# Altium schematic sheet A3000_16MB_M4.SchDoc: ARM2 to ARM3 Adapter
size A3; DocumentNumber: 1; SheetNumber: 5; SheetTotal: 5
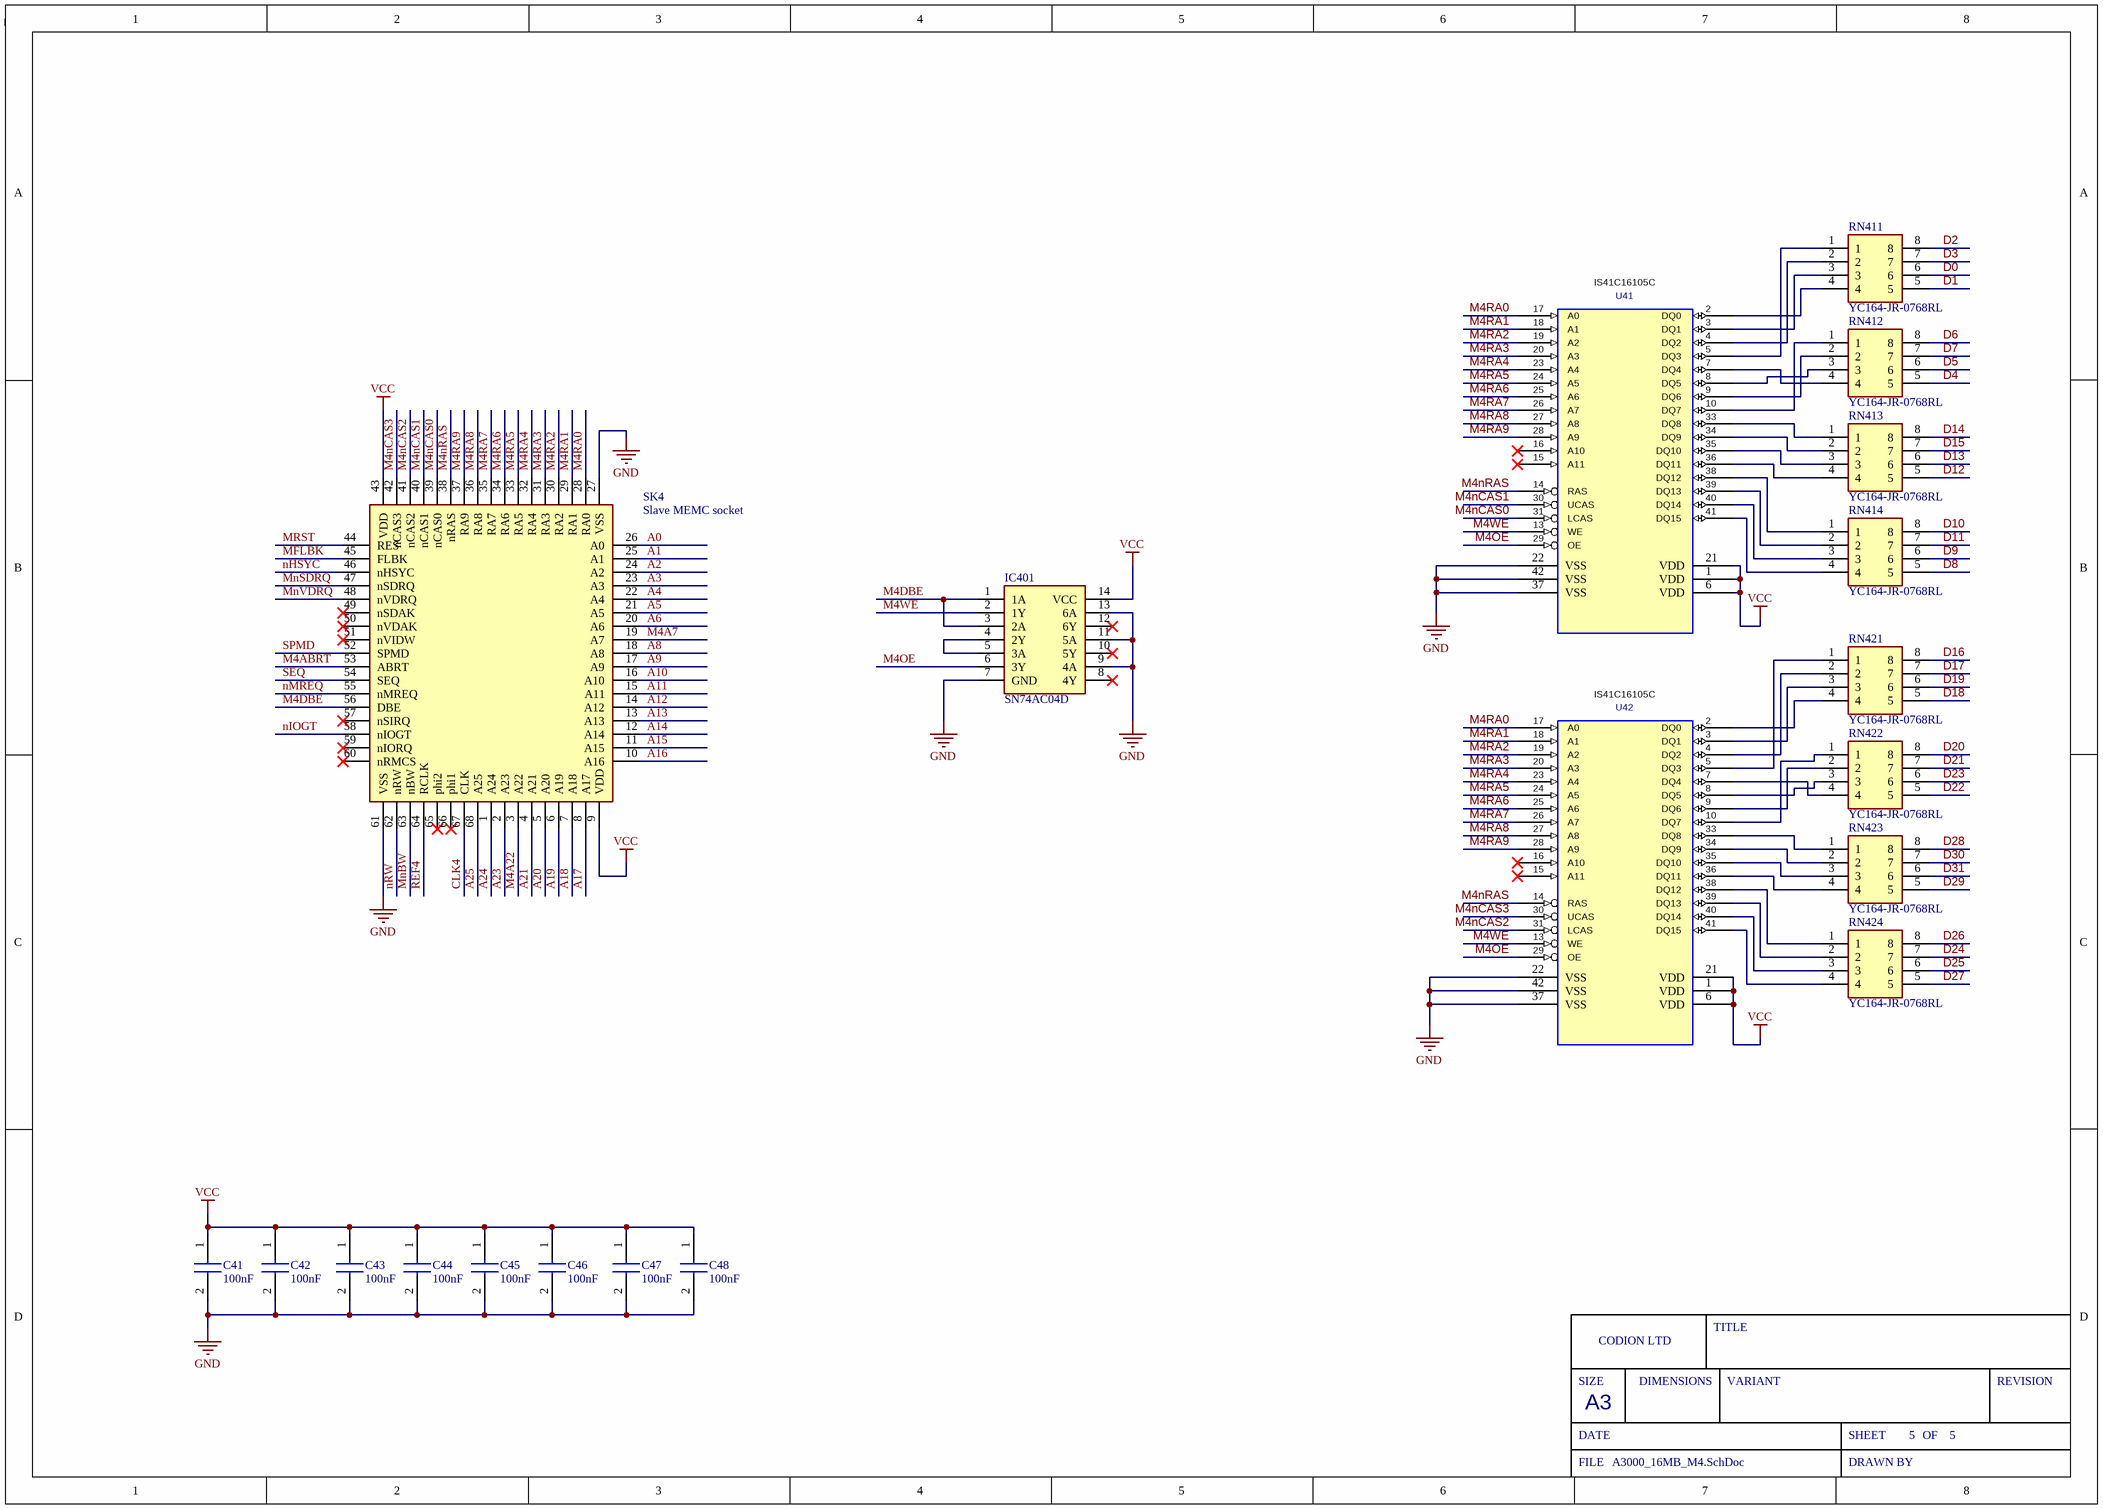
[diagram p0: A3000_16MB_M4.SchDoc]

## Parts
C41  100nF  [CAPC2012X145N]
C42  100nF  [CAPC2012X145N]
C43  100nF  [CAPC2012X145N]
C44  100nF  [CAPC2012X145N]
C45  100nF  [CAPC2012X145N]
C46  100nF  [CAPC2012X145N]
C47  100nF  [CAPC2012X145N]
C48  100nF  [CAPC2012X145N]
IC401  SN74AC04D  [SOIC127P600X175-14N]
RN411  YC164-JR-0768RL  [YC164JR0768RL]
RN412  YC164-JR-0768RL  [YC164JR0768RL]
RN413  YC164-JR-0768RL  [YC164JR0768RL]
RN414  YC164-JR-0768RL  [YC164JR0768RL]
RN421  YC164-JR-0768RL  [YC164JR0768RL]
RN422  YC164-JR-0768RL  [YC164JR0768RL]
RN423  YC164-JR-0768RL  [YC164JR0768RL]
RN424  YC164-JR-0768RL  [YC164JR0768RL]
SK4  Slave MEMC socket  [MEMC_Socket]
U41  IS41C16105C  [SOJ-42]
U42  IS41C16105C  [SOJ-42]

## Nets
GND: C41.2 C42.2 C43.2 C44.2 C45.2 C46.2 C47.2 C48.2 IC401.7(GND) IC401.9(4A) IC401.11(5A) IC401.13(6A) SK4.27(VSS) SK4.61(VSS) U41.22(VSS) U41.37(VSS) U41.42(VSS) U42.22(VSS) U42.37(VSS) U42.42(VSS)
VCC: C41.1 C42.1 C43.1 C44.1 C45.1 C46.1 C47.1 C48.1 IC401.14(VCC) SK4.9(VDD) SK4.43(VDD) U41.1(VCC) U41.6(VCC) U41.21(VCC) U42.1(VCC) U42.6(VCC) U42.21(VCC)
A0: SK4.26(A0)
A1: SK4.25(A1)
A2: SK4.24(A2)
A3: SK4.23(A3)
A4: SK4.22(A4)
A5: SK4.21(A5)
A6: SK4.20(A6)
A8: SK4.18(A8)
A9: SK4.17(A9)
A10: SK4.16(A10)
A11: SK4.15(A11)
A12: SK4.14(A12)
A13: SK4.13(A13)
A14: SK4.12(A14)
A15: SK4.11(A15)
A16: SK4.10(A16)
A17: SK4.8(A17)
A18: SK4.7(A18)
A19: SK4.6(A19)
A20: SK4.5(A20)
A21: SK4.4(A21)
A23: SK4.2(A23)
A24: SK4.1(A24)
A25: SK4.68(A25)
CLK4: SK4.67(CLK)
D0: RN411.6
D1: RN411.5
D2: RN411.8
D3: RN411.7
D4: RN412.5
D5: RN412.6
D6: RN412.8
D7: RN412.7
D8: RN414.5
D9: RN414.6
D10: RN414.8
D11: RN414.7
D12: RN413.5
D13: RN413.6
D14: RN413.8
D15: RN413.7
D16: RN421.8
D17: RN421.7
D18: RN421.5
D19: RN421.6
D20: RN422.8
D21: RN422.7
D22: RN422.5
D23: RN422.6
D24: RN424.7
D25: RN424.6
D26: RN424.8
D27: RN424.5
D28: RN423.8
D29: RN423.5
D30: RN423.7
D31: RN423.6
M4A7: SK4.19(A7)
M4A22: SK4.3(A22)
M4ABRT: SK4.53(ABRT)
M4DBE: IC401.1(1A) IC401.3(2A) SK4.56(DBE)
M4nCAS0: SK4.39(nCAS0) U41.31(LCAS)
M4nCAS1: SK4.40(nCAS1) U41.30(UCAS)
M4nCAS2: SK4.41(nCAS2) U42.31(LCAS)
M4nCAS3: SK4.42(nCAS3) U42.30(UCAS)
M4nRAS: SK4.38(nRAS) U41.14(RAS) U42.14(RAS)
M4OE: IC401.6(3Y) U41.29(OE) U42.29(OE)
M4RA0: SK4.28(RA0) U41.17(A0) U42.17(A0)
M4RA1: SK4.29(RA1) U41.18(A1) U42.18(A1)
M4RA2: SK4.30(RA2) U41.19(A2) U42.19(A2)
M4RA3: SK4.31(RA3) U41.20(A3) U42.20(A3)
M4RA4: SK4.32(RA4) U41.23(A4) U42.23(A4)
M4RA5: SK4.33(RA5) U41.24(A5) U42.24(A5)
M4RA6: SK4.34(RA6) U41.25(A6) U42.25(A6)
M4RA7: SK4.35(RA7) U41.26(A7) U42.26(A7)
M4RA8: SK4.36(RA8) U41.27(A8) U42.27(A8)
M4RA9: SK4.37(RA9) U41.28(A9) U42.28(A9)
M4WE: IC401.2(1Y) U41.13(WE) U42.13(WE)
MFLBK: SK4.45(FLBK)
MnBW: SK4.63(nBW)
MnSDRQ: SK4.47(nSDRQ)
MnVDRQ: SK4.48(nVDRQ)
MRST: SK4.44(RES)
nHSYC: SK4.46(nHSYC)
nIOGT: SK4.58(nIOGT)
nMREQ: SK4.55(nMREQ)
nRW: SK4.62(nRW)
REF4: SK4.64(RCLK)
SEQ: SK4.54(SEQ)
SPMD: SK4.52(SPMD)
NetIC401_4: IC401.4(2Y) IC401.5(3A)
NetRN411_1: RN411.1 U41.5(DQ3)
NetRN411_2: RN411.2 U41.4(DQ2)
NetRN411_3: RN411.3 U41.3(DQ1)
NetRN411_4: RN411.4 U41.2(DQ0)
NetRN412_1: RN412.1 U41.10(DQ7)
NetRN412_2: RN412.2 U41.9(DQ6)
NetRN412_3: RN412.3 U41.8(DQ5)
NetRN412_4: RN412.4 U41.7(DQ4)
NetRN413_1: RN413.1 U41.33(DQ8)
NetRN413_2: RN413.2 U41.34(DQ9)
NetRN413_3: RN413.3 U41.35(DQ10)
NetRN413_4: RN413.4 U41.36(DQ11)
NetRN414_1: RN414.1 U41.38(DQ12)
NetRN414_2: RN414.2 U41.39(DQ13)
NetRN414_3: RN414.3 U41.40(DQ14)
NetRN414_4: RN414.4 U41.41(DQ15)
NetRN421_1: RN421.1 U42.5(DQ3)
NetRN421_2: RN421.2 U42.4(DQ2)
NetRN421_3: RN421.3 U42.3(DQ1)
NetRN421_4: RN421.4 U42.2(DQ0)
NetRN422_1: RN422.1 U42.10(DQ7)
NetRN422_2: RN422.2 U42.9(DQ6)
NetRN422_3: RN422.3 U42.8(DQ5)
NetRN422_4: RN422.4 U42.7(DQ4)
NetRN423_1: RN423.1 U42.33(DQ8)
NetRN423_2: RN423.2 U42.34(DQ9)
NetRN423_3: RN423.3 U42.35(DQ10)
NetRN423_4: RN423.4 U42.36(DQ11)
NetRN424_1: RN424.1 U42.38(DQ12)
NetRN424_2: RN424.2 U42.39(DQ13)
NetRN424_3: RN424.3 U42.40(DQ14)
NetRN424_4: RN424.4 U42.41(DQ15)

Not connected (* = marked no-connect by the designer): IC401 8(4Y)* 10(5Y)* 12(6Y)*; SK4 49(nSDAK)* 50(nVDAK)* 51(nVIDW)* 57(nSIRQ)* 59(nIORQ)* 60(nRMCS)* 65(phi2)* 66(phi1)*; U41 15(A11)* 16(A10)*; U42 15(A11)* 16(A10)*

## Notes on the sheet
- SIZE
- CODION LTD
- DIMENSIONS
- TITLE
- VARIANT
- REVISION
- DATE
- A3
- SHEET
- OF
- FILE
- DRAWN BY

## Library data of the parts
C41-C48 = C2012X7R1H104K125AM: Capacitor; Manufacturer_Name: TDK; Datasheet Link: https://product.tdk.com/info/en/catalog/datasheets/mlcc_commercial_midvoltage_en.pdf; Height: 1.45mm; Manufacturer_Part_Number: C2012X7R1H104K125AM; Mouser Part Number: 810-C2012X7R1H104KT5; Mouser Price/Stock: https://www.mouser.com/Search/Refine.aspx?Keyword=810-C2012X7R1H104KT5; Arrow Part Number: C2012X7R1H104K125AM; Arrow Price/Stock: https://www.arrow.com/en/products/c2012x7r1h104k125am/tdk; LCSC Part #: C111492
IC401 = SN74AC04D: Integrated Circuit; Manufacturer_Name: Texas Instruments; Datasheet Link: http://www.ti.com/lit/ds/symlink/sn74ac04.pdf; Height: 1.75mm; Manufacturer_Part_Number: SN74AC04D; Mouser Part Number: 595-SN74AC04D; Mouser Price/Stock: https://www.mouser.co.uk/ProductDetail/Texas-Instruments/SN74AC04D?qs=w32V8uFkMxkvsyMHHacuZw%3D%3D; Arrow Part Number: SN74AC04D; Arrow Price/Stock: https://www.arrow.com/en/products/sn74ac04d/texas-instruments?region=nac; LCSC Part #: C352940
RN411-RN414 RN421-RN424 = YC164-JR-0768RL: Resistor Network; Manufacturer_Name: KEMET; Datasheet Link: https://www.yageo.com/upload/media/product/productsearch/datasheet/rchip/PYu-YC_TC_group_51_RoHS_L_9.pdf; Height: 0.7mm; Manufacturer_Part_Number: YC164-JR-0768RL; Mouser Part Number: 603-YC164-JR-0768RL; Mouser Price/Stock: https://www.mouser.co.uk/ProductDetail/Yageo/YC164-JR-0768RL?qs=8cPjvKtxWv7AOp%2F0jDxI3w%3D%3D; Arrow Part Number: YC164-JR-0768RL; Arrow Price/Stock: https://www.arrow.com/en/products/yc164-jr-0768rl/yageo; LCSC Part #: C695188
SK4 = MEMC_Skt: MEMC socket; Manufacturer_Name: 3M; Manufacturer_Part_Number: 8468-21B1-RK-TR; Datasheet Link: https://www.arrow.com/en/products/8468-21b1-rk-tr/3m; Height: 4.6mm; Mouser Part Number: 517-8468-21B1-RK-TR; Mouser Price/Stock: https://www.mouser.co.uk/ProductDetail/3M-Electronic-Solutions-Division/8468-21B1-RK-TR?qs=X%2F%2F06fXhnJ18zOj3KK47CQ%3D%3D; Arrow Part Number: 8468-21B1-RK-TR; Arrow Price/Stock: https://www.arrow.com/en/products/8468-21b1-rk-tr/3m
U41 U42 = DRAM_1MX16_SOJ: Value: IS41C16105C